# Altium schematic sheet vraimenthorspcb.SchDoc
size A
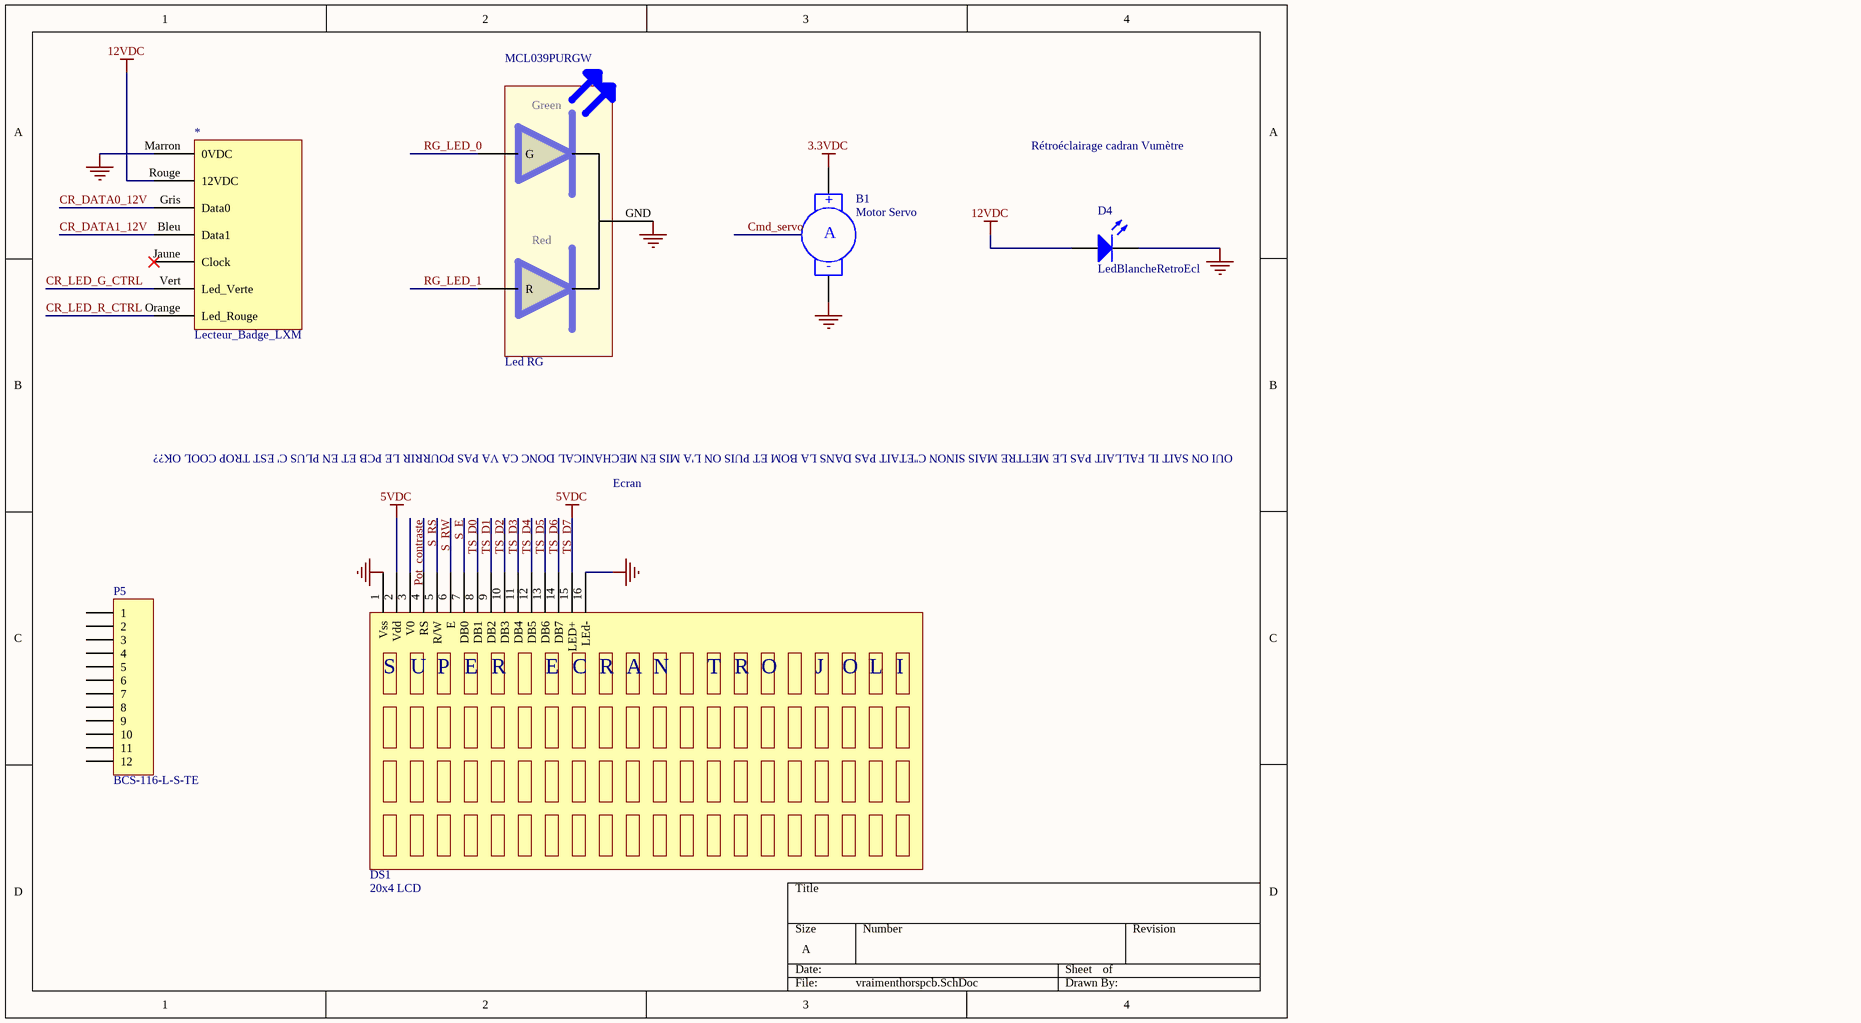
[diagram p0: vraimenthorspcb.SchDoc]

## Parts
*  Lecteur_Badge_LXM  (mechanical)
B1  Motor Servo  [RAD-0.4]  (mechanical)
D4  LedBlancheRetroEcl  [LED-0]  (mechanical)
DS1  20x4 LCD  (mechanical)
MCL039PURGW  Led RG  (mechanical)
P5  BCS-116-L-S-TE  [HDR1X12]  (mechanical)

## Nets
3.3VDC: B1.1(+)
5VDC: DS1.2(Vdd) DS1.15(LED+)
12VDC: *.Rouge(12VDC) D4.1(A)
GND: *.Marron(0VDC) B1.2(-) D4.2(K) DS1.1(Vss) DS1.16(LEd-) MCL039PURGW.GND
CR_DATA0_12V: *.Gris(Data0)
CR_DATA1_12V: *.Bleu(Data1)
CR_LED_G_CTRL: *.Vert(Led_Verte)
CR_LED_R_CTRL: *.Orange(Led_Rouge)
Pot_contraste: DS1.3(V0)
RG_LED_0: MCL039PURGW.G
RG_LED_1: MCL039PURGW.R
S_E: DS1.6(E)
S_RS: DS1.4(RS)
S_RW: DS1.5(R/W)
TS_D0: DS1.7(DB0)
TS_D1: DS1.8(DB1)
TS_D2: DS1.9(DB2)
TS_D3: DS1.10(DB3)
TS_D4: DS1.11(DB4)
TS_D5: DS1.12(DB5)
TS_D6: DS1.13(DB6)
TS_D7: DS1.14(DB7)

Not connected (* = marked no-connect by the designer): * Jaune(Clock)*; P5 1 2 3 4 5 6 7 8 9 10 11 12

## Notes on the sheet
- Rétroéclairage cadran Vumètre
- Ecran
- OUI ON SAIT IL FALLAIT PAS LE METTRE MAIS SINON C''ETAIT PAS DANS LA BOM ET PUIS ON L'A MIS EN MECHANICAL DONC CA VA PAS POURRIR LE PCB ET EN PLUS C' EST TROP COOL OK??
- (in symbol MC42008A6W-FPTLW) S; U; P; R; C; A; N; T; O; J; L; I
- (in symbol MCL039PURGW) Green; Red
- (in symbol Motor Servo) A

## Library data of the parts
* = Lecteur_Badge_LXM: Fournisseur: Gregoire; Fabricant: Stid-Security; Ref.Fournisseur: :); Ref.Fabricant: LXM_WIEGAND44b
B1 = Motor Servo: Servo Motor; Fournisseur: Olimex; Ref.Fournisseur: MS-R-1.3-9; Fabricant: Olimex; Ref.Fabricant: MS-R-1.3-9
D4 = LED0: LED Blanche retro vumetre; Fournisseur: BARBIE; Fabricant: N/A; Ref.Fabricant: N/A; Ref.Fournisseur: N/A
DS1 = MC42008A6W-FPTLW: Fournisseur: Farnell; Ref.Fournisseur: 2606880; Fabricant: Midas; Ref.Fabricant: MC42008A6W-FPTLW
MCL039PURGW = MCL039PURGW: Fournisseur: Farnell; Fabricant: Multicomp; Ref.Fournisseur: 1581194; Ref.Fabricant: MCL039PURGW
P5 = Header 12: Header, 12-Pin; Fournisseur: Farnell; Ref.Fournisseur: 1667483; Fabricant: Samtec; Ref.Fabricant: BCS-116-L-S-TE